# Altium schematic sheet switches.SchDoc
size A; SheetNumber: 8; SheetTotal: 11
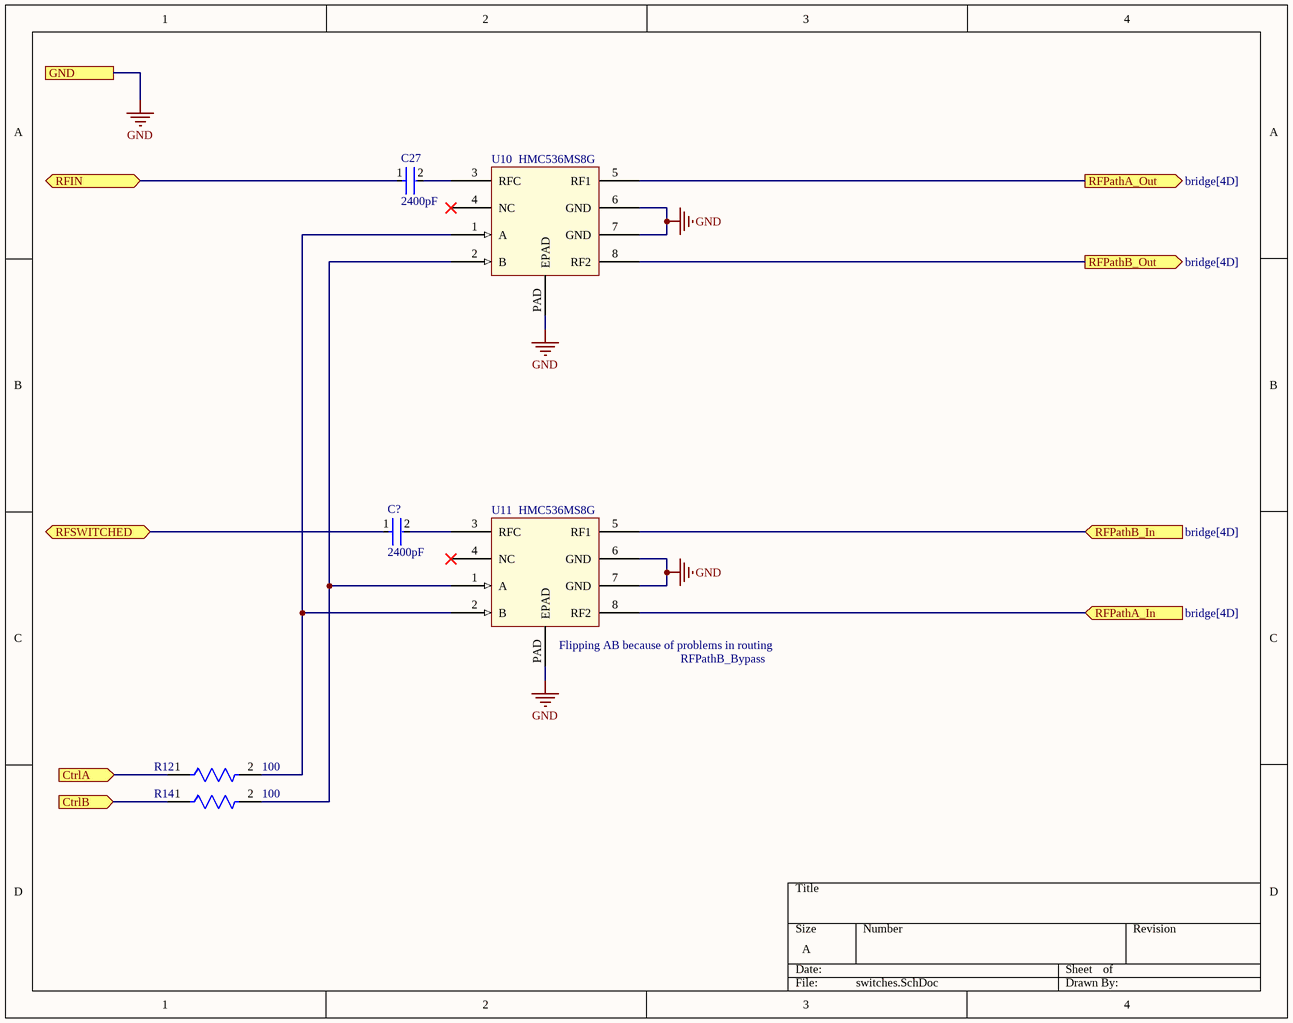
[diagram p0: switches.SchDoc]

## Parts
C27  2400pF  [FP-GRM188-0_1-e0_2_0_5-MFG]
C?  2400pF  [FP-GRM188-0_1-e0_2_0_5-MFG]
R12  100  [FP-RC0603-0_55-MFG]
R14  100  [FP-RC0603-0_55-MFG]
U10  HMC536MS8G  [RH_8_1_ADI]
U11  HMC536MS8G  [RH_8_1_ADI]

## Ports
CtrlA (in, see bridge[5D]), CtrlB (in, see bridge[5D]), GND (see bridge[5D], AMP_LO[1C], doubler[3C], mixer[2C], power[2B], split2[2C], split4[2C]), RFIN (bidir, see bridge[5D]), RFPathA_In (in, see bridge[4D]), RFPathA_Out (out, see bridge[4D]), RFPathB_In (in, see bridge[4D]), RFPathB_Out (out, see bridge[4D]), RFSWITCHED (bidir, see bridge[4D])

## Nets
GND: U10.6(GND) U10.7(GND) U10.PAD(EPAD) U11.6(GND) U11.7(GND) U11.PAD(EPAD) ; port GND
CtrlA: R12.1 ; port CtrlA
CtrlB: R14.1 ; port CtrlB
RFIN: C27.1 ; port RFIN
RFPathA_In: U11.8(RF2) ; port RFPathA_In
RFPathA_Out: U10.5(RF1) ; port RFPathA_Out
RFPathB_In: U11.5(RF1) ; port RFPathB_In
RFPathB_Out: U10.8(RF2) ; port RFPathB_Out
RFSWITCHED: C?.1 ; port RFSWITCHED
NetC27_2: C27.2 U10.3(RFC)
NetC?_2: C?.2 U11.3(RFC)
NetR12_2: R12.2 U10.1(A) U11.2(B)
NetR14_2: R14.2 U10.2(B) U11.1(A)

Not connected (* = marked no-connect by the designer): U10 4(NC)*; U11 4(NC)*

## Notes on the sheet
- (near U11) Flipping AB because of problems in routing
- RFPathB_Bypass

## Library data of the parts
C27 C? = CMP-2006-02639-2: GRM1885C1H242JA01D; Chip Multilayer Ceramic Capacitors for General Purpose, 0603, 2400pF, C0G, 30ppm/°C, 5%, 50V; Capacitance: 2.4nF; Max Operating Temperature: 125°C; Thickness: 0.035inch; Width: 0.031inch; Voltage Rating (DC): 50V; Voltage Rating: 50V; Length: 1.6mm; Dielectric: C0G; Radiation Hardening: No; Lead Free: Lead Free; Case/Package: 0603; Height: 0.8mm; Termination: SMD/SMT; Tolerance: 5%; Case Code (Imperial): 0603; Voltage: 50V; Depth: 0.8mm; Mount: Surface Mount; Case Code (Metric): 1608; Packaging: Tape and Reel; Package Quantity: 4000; Min Operating Temperature: -55°C
R12 R14 = CMP-2000-05021-2: RES SMD 100 OHM 5% 1/10W 0603; Temperature Coefficient: 100ppm/°C; Voltage Rating (DC): 50V; Power Rating: 100mW; Resistance: 100R; Features: Moisture Resistant; Width: 0.8mm; RoHS Compliant: Yes; Series: RC; Case Code (Metric): 1608; Packaging: Tape and Reel; Construction: Rectangular; Contact Plating: Tin; Resistor Type: Thick Film; Case/Package: 0603; Military Standard: Not; Case Code (Imperial): 0603; Number of Pins: 2; Length: 1.6mm; Size Code: 0603; Voltage Rating: 50V; Min Operating Temperature: -55°C; Max Power Dissipation: 100mW; Tolerance: 5%; Lead Free: Lead Free; Termination: SMD/SMT; Resistance Tolerance: 5%; Depth: 0.8mm; Max Operating Temperature: 155°C; Number of Terminations: 2; Radiation Hardening: No
U10 U11 = HMC536MS8G: RF Switch ICs 3 Watt SPDT T/R Switch SMT, DC - 6 GHz